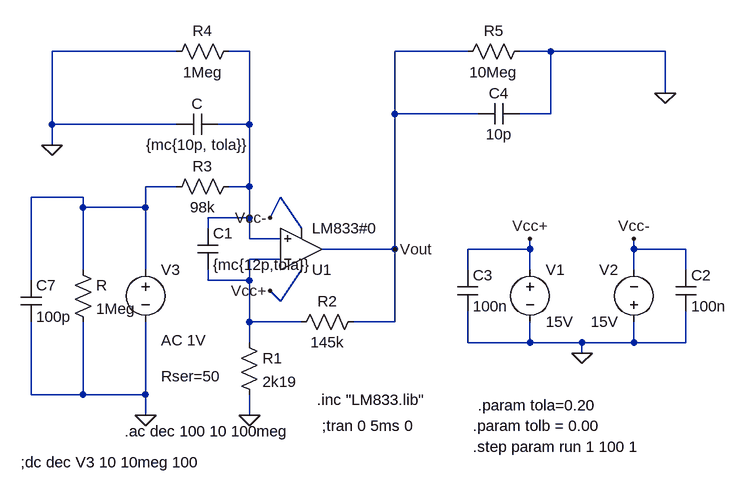
[diagram p0: schematic tc_tp2_ej2.asc]
tc_tp2_ej2.asc, the LTspice schematic file:
Version 4
SHEET 1 880 680
WIRE -272 -192 -464 -192
WIRE -160 -192 -192 -192
WIRE 176 -192 64 -192
WIRE 304 -192 256 -192
WIRE 480 -192 304 -192
WIRE 480 -128 480 -192
WIRE 64 -96 64 -192
WIRE 192 -96 64 -96
WIRE 304 -96 304 -192
WIRE 304 -96 256 -96
WIRE -464 -80 -464 -192
WIRE -272 -80 -464 -80
WIRE -160 -80 -160 -192
WIRE -160 -80 -208 -80
WIRE -464 -48 -464 -80
WIRE -272 16 -320 16
WIRE -160 16 -160 -80
WIRE -160 16 -192 16
WIRE -416 32 -496 32
WIRE -416 48 -416 32
WIRE -320 48 -320 16
WIRE -320 48 -416 48
WIRE -160 64 -160 16
WIRE -160 64 -224 64
WIRE -128 64 -112 32
WIRE -224 80 -224 64
WIRE -80 80 -112 32
WIRE -160 96 -160 64
WIRE -112 96 -160 96
WIRE 64 112 64 -96
WIRE 64 112 -48 112
WIRE 272 112 272 96
WIRE 272 112 176 112
WIRE 432 112 432 96
WIRE 512 112 432 112
WIRE -112 128 -160 128
WIRE -416 144 -416 48
WIRE -320 144 -320 48
WIRE 176 144 176 112
WIRE 272 144 272 112
WIRE 432 144 432 112
WIRE 512 144 512 112
WIRE -496 160 -496 32
WIRE -224 160 -224 144
WIRE -160 160 -160 128
WIRE -160 160 -224 160
WIRE -112 192 -80 144
WIRE -112 192 -128 176
WIRE -160 224 -160 160
WIRE -80 224 -160 224
WIRE 64 224 64 112
WIRE 64 224 0 224
WIRE -160 256 -160 224
WIRE 176 256 176 208
WIRE 272 256 272 224
WIRE 272 256 176 256
WIRE 352 256 272 256
WIRE 432 256 432 224
WIRE 432 256 352 256
WIRE 512 256 512 208
WIRE 512 256 432 256
WIRE 352 272 352 256
WIRE -496 336 -496 224
WIRE -416 336 -416 224
WIRE -416 336 -496 336
WIRE -320 336 -320 224
WIRE -320 336 -416 336
WIRE -320 368 -320 336
WIRE -160 368 -160 336
FLAG 352 272 0
FLAG 272 96 Vcc+
FLAG 432 96 Vcc-
FLAG -320 368 0
FLAG -128 176 Vcc+
FLAG -128 64 Vcc-
FLAG -160 368 0
FLAG 64 112 Vout
FLAG -464 -48 0
FLAG 480 -128 0
SYMBOL voltage 272 128 R0
WINDOW 123 0 0 Left 2
WINDOW 39 0 0 Left 2
SYMATTR InstName V1
SYMATTR Value 15V
SYMBOL voltage 432 240 R180
WINDOW 0 24 96 Left 2
WINDOW 3 24 16 Left 2
WINDOW 123 0 0 Left 2
WINDOW 39 0 0 Left 2
SYMATTR InstName V2
SYMATTR Value 15V
SYMBOL res -176 240 R0
SYMATTR InstName R1
SYMATTR Value 2k19
SYMBOL res 16 208 R90
WINDOW 0 0 56 VBottom 2
WINDOW 3 32 56 VTop 2
SYMATTR InstName R2
SYMATTR Value 145k
SYMBOL res -176 0 R90
WINDOW 0 0 56 VBottom 2
WINDOW 3 32 56 VTop 2
SYMATTR InstName R3
SYMATTR Value 98k
SYMBOL voltage -320 128 R0
WINDOW 3 24 152 Left 2
WINDOW 123 24 124 Left 2
WINDOW 39 24 180 Left 2
SYMATTR Value ""
SYMATTR Value2 AC 1V
SYMATTR SpiceLine Rser=50
SYMATTR InstName V3
SYMBOL Opamps\\opamp2 -80 176 M180
SYMATTR InstName U1
SYMATTR Value LM833#0
SYMBOL cap 496 144 R0
SYMATTR InstName C2
SYMATTR Value 100n
SYMBOL cap 160 144 R0
SYMATTR InstName C3
SYMATTR Value 100n
SYMBOL cap -208 -96 R90
WINDOW 0 0 32 VBottom 2
WINDOW 3 32 32 VTop 2
SYMATTR InstName C
SYMATTR Value {mc{10p, tola}}
SYMBOL res -176 -208 R90
WINDOW 0 0 56 VBottom 2
WINDOW 3 32 56 VTop 2
SYMATTR InstName R4
SYMATTR Value 1Meg
SYMBOL res -432 128 R0
SYMATTR InstName R
SYMATTR Value 1Meg
SYMBOL cap -512 160 R0
SYMATTR InstName C7
SYMATTR Value 100p
SYMBOL res 272 -208 R90
WINDOW 0 0 56 VBottom 2
WINDOW 3 32 56 VTop 2
SYMATTR InstName R5
SYMATTR Value 10Meg
SYMBOL cap 256 -112 R90
WINDOW 0 0 32 VBottom 2
WINDOW 3 32 32 VTop 2
SYMATTR InstName C4
SYMATTR Value 10p
SYMBOL cap -240 80 R0
SYMATTR InstName C1
SYMATTR Value {mc{12p,tola}}
TEXT -56 344 Left 2 !.inc "LM833.lib"
TEXT -352 392 Left 2 !.ac dec 100 10 100meg
TEXT -48 384 Left 2 !;tran 0 5ms 0
TEXT 192 352 Left 2 !.param tola=0.20
TEXT 184 384 Left 2 !.param tolb = 0.00
TEXT 184 416 Left 2 !.step param run 1 100 1
TEXT -512 440 Left 2 !;dc dec V3 10 10meg 100

The netlist it stands for:
* tc_tp2_ej2.asc
V1 Vcc+ 0 15V
V2 0 Vcc- 15V
R1 N003 0 2k19
R2 Vout N003 145k
R3 N001 N002 98k
V3 N002 0 AC 1V Rser=50
XU1 N001 N003 Vcc+ Vcc- Vout LM833#0  ; pins In+ In- V+ V- OUT
C2 Vcc- 0 100n
C3 Vcc+ 0 100n
C N001 0 {mc{10p, tola}}
R4 N001 0 1Meg
R N002 0 1Meg
C7 N002 0 100p
R5 0 Vout 10Meg
C4 0 Vout 10p
C1 N001 N003 {mc{12p,tola}}
.inc "LM833.lib"
.ac dec 100 10 100meg
;tran 0 5ms 0
.param tola=0.20
.param tolb = 0.00
.step param run 1 100 1
;dc dec V3 10 10meg 100
.backanno
.end